# EAGLE design hss-mag-enc-v1 (EAGLE 7.6.0)
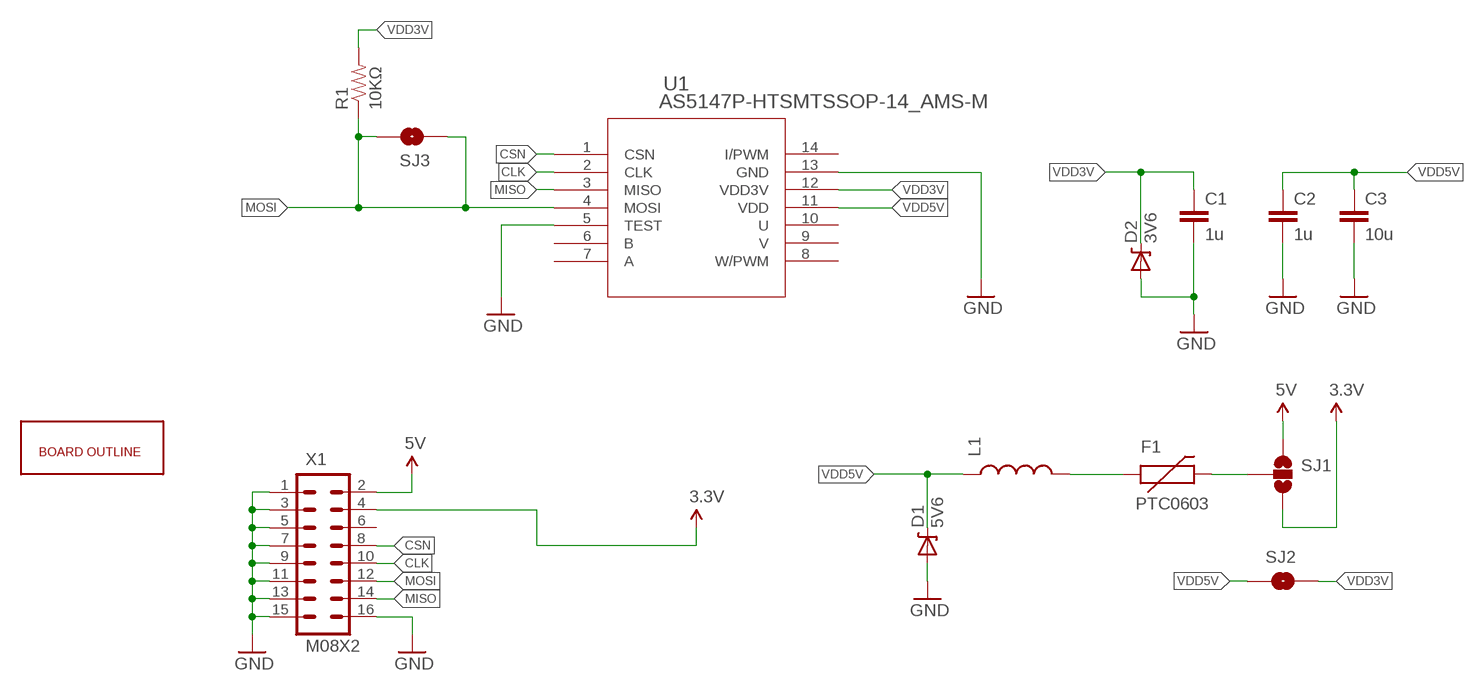
[diagram p0: schematic, sheet 1]

## Parts
C1  1u  CAP0805  [0805]
C2  1u  CAP0805  [0805]
C3  10u  CAP0805  [0805]
D1  5V6  DIODE-ZENER-BZT52  [SOD-323]
D2  3V6  DIODE-ZENER-BZT52  [SOD-323]
F1  PTC0603  [0603]
L1  INDUCTOR0805  [0805]
R1  10KΩ  RESISTOR0603-RES  [0603-RES]
SJ1  SOLDERJUMPER_2WAYS  [SJ_3]
SJ2  SOLDERJUMPERNO  [SJ_2S-NO]
SJ3  SOLDERJUMPERNO  [SJ_2S-NO]
U1  AS5147P-HTSMTSSOP-14_AMS-M  [TSSOP-14_AMS-M]
U$1  BOARD-OUTLINE-V1  [BOARD-OUTLINE]
X1  M08X2  [2X8]

## Nets
3.3V: SJ1.3 X1.4
5V: SJ1.1 X1.2
CLK: U1.2(CLK) X1.10
CSN: U1.1(CSN) X1.8
GND: C1.2 C2.2 C3.2 D1.2(A) D2.2(A) U1.5(TEST) U1.13(GND) X1.1 X1.3 X1.5 X1.7 X1.9 X1.11 X1.13 X1.15 X1.16
MISO: U1.3(MISO) X1.14
MOSI: R1.1 SJ3.1 SJ3.2 U1.4(MOSI) X1.12
N$1: F1.1 L1.2
N$2: F1.2 SJ1.2
VDD3V: C1.1 D2.1(C) R1.2 SJ2.2 U1.12(VDD3V)
VDD5V: C2.1 C3.1 D1.1(C) L1.1 SJ2.1 U1.11(VDD)
Unconnected: U1.6(B) U1.7(A) U1.8(W/PWM) U1.9(V) U1.10(U) U1.14(I/PWM) X1.6

## Library data of the parts
C1-C3 = hss-mag-enc:CAP: Capacitor Standard 0603 ceramic capacitor, and 0.1" leaded capacitor.
D1 D2 = hss-mag-enc:DIODE-ZENER: Zener Diode Production Part - 8199 3.4V Zener Voltage
F1 = hss-mag-enc:PTC: Resettable Fuse PTC Resettable Fuse. Spark Fun Electronics SKU : COM-08357
L1 = hss-mag-enc:INDUCTOR: Inductors Basic Inductor/Choke - 0603 and 1206. Footprints are not proven and vary greatly between part numbers.
R1 = hss-mag-enc:RESISTOR: Resistor Basic schematic elements and footprints for 0603, 1206, and PTH resistors.
SJ1 = hss-mag-enc:SOLDERJUMPER_2WAY: Solder Jumper 2 way solder jumper
SJ2 SJ3 = hss-mag-enc:SOLDERJUMPER: Solder Jumper Standard SMD solder jumper. Used to automate production. Two varients : Normally Open and Normally Closed are the same, but have different paste layers. NC will have a large amount of paste and should jumper during reflow.
U1 = hss-mag-enc:AS5147P-HTSM; COPYRIGHT: Copyright (C) 2025 Ultra Librarian. All rights reserved.; MANUFACTURER_NAME: AMS; MANUFACTURER_PART_NUMBER: AS5147P-HTSM
U$1 = hss-mag-enc:BOARD-OUTLINE
X1 = hss-mag-enc:M08X2

## Board
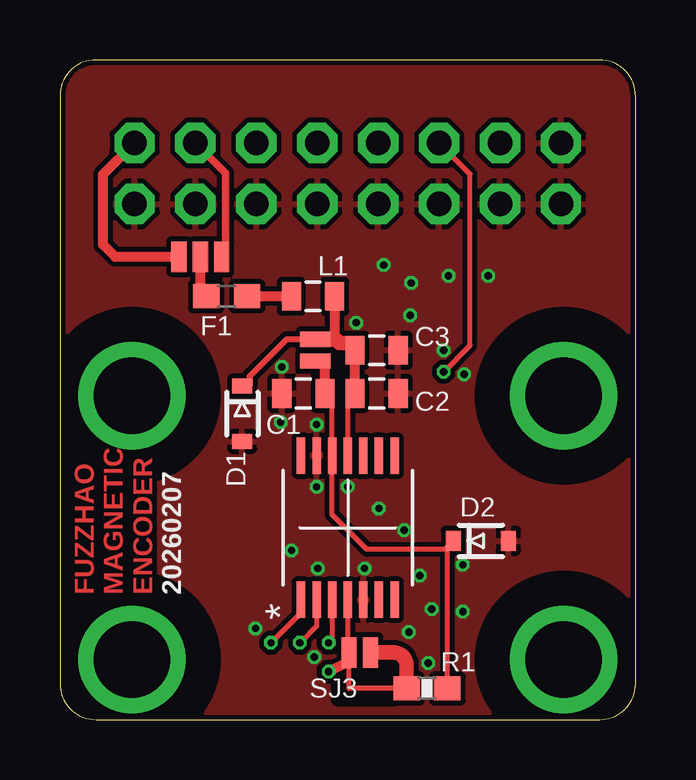
[diagram p1: board, top side]
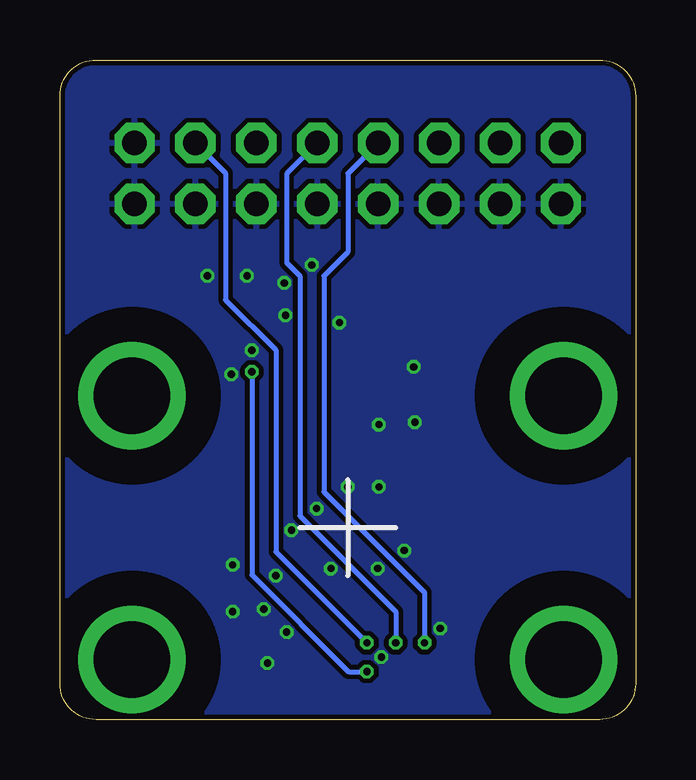
[diagram p2: board, bottom side, seen from below]

Size 24 x 27.5 mm. Coordinates in mm from the lower left corner, seen from the top.
Outline: 22.5,27.5 1.5,27.5 arc90 0,26 0,1.5 arc90 1.5,0 22.5,0 arc90 24,1.5 24,26 arc90 22.5,27.5
Copper layers (1*16): Top 0.035mm / dielectric 0.2mm / Bottom 0.035mm
Design rules "jlcpcb-4layers *": minimum track width 3mil, minimum drill 0.2mm, track to track 5mil, track to pad 5mil, pad to pad 5mil, via to via 5mil, smd to smd 5mil, copper to edge 0.2mm, drill to drill 6mil, minimum pad ring 8mil, minimum via ring 0.13mm, stop-mask expansion 0.05mm, vias tented up to drill 16mil, thermal gap 8mil
tRestrict: 2 lines

### Footprints (pad centres in the part's own frame; a part is rotated, then mirrored left to right if it is on the bottom)
0805 = smd 0.8 x 1.2: 1 -0.9,0; 2 0.9,0
SOD-323 = smd 0.63 x 0.83: 1 -1.15,0; 2 1.15,0
0603 = smd 1.1 x 1: 1 -0.85,0; 2 0.85,0
0603-RES = smd 1.1 x 1: 1 -0.85,0; 2 0.85,0
SJ_3 = smd 0.635 x 1.27: 1 -0.889,0; 2 0,0; 3 0.889,0
SJ_2S-NO = smd 0.635 x 1.27: 1 -0.45,0; 2 0.45,0
TSSOP-14_AMS-M = smd 1.511 x 0.356: 1 -3.004,1.95; 2 -3.004,1.3; 3 -3.004,0.65; 4 -3.004,0; 5 -3.004,-0.65; 6 -3.004,-1.3; 7 -3.004,-1.95; 8 3.004,-1.95; 9 3.004,-1.3; 10 3.004,-0.65; 11 3.004,0; 12 3.004,0.65; 13 3.004,1.3; 14 3.004,1.95
BOARD-OUTLINE = drill 3.2 pad 3.81: 1 2,2; 2 2,13; 3 20,13; 4 20,2
2X8 = drill 1.016 pad 1.676 octagon: 1 0,0; 2 0,2.54; 3 2.54,0; 4 2.54,2.54; 5 5.08,0; 6 5.08,2.54; 7 7.62,0; 8 7.62,2.54; 9 10.16,0; 10 10.16,2.54; 11 12.7,0; 12 12.7,2.54; 13 15.24,0; 14 15.24,2.54; 15 17.78,0; 16 17.78,2.54

### Placement (x,y rotation side)
C1  10.15,13.6 180 top
C2  13.2,13.6 0 top
C3  13.2,15.4 0 top
D1  7.6,12.75 270 top
D2  17.55,7.45 0 top
F1  6.95,17.65 180 top
L1  10.55,17.65 180 top
R1  15.3,1.3 0 top
SJ1  5.85,19.3 0 top
SJ2  10.65,15.4 270 top
SJ3  12.5,2.8 180 top
U1  12,8 90 top
U$1  1,0.5 0 top
X1  3.11,21.5 0 top

### Tracks (layer width: path | path; a pad name or v marks a point on that pad's centre or on a via)
3.3V
  Top 0.305: X1.4 6.9,22.79 6.9,19.85 6.74,19.69 SJ1.3
5V
  Top 0.406: X1.2 1.8,22.73 1.8,19.8 2.3,19.3 SJ1.1
CLK  (via drill 0.3)
  Top 0.203: U1.2 10.7,3.9 v10,3.2
  Bottom 0.203: X1.10 14.55,22.76 14.55,19.05 14,18.5 14,8.5 10,4.5 v10,3.2
CSN  (via drill 0.3)
  Top 0.203: U1.1 10.05,4.45 v8.8,3.2
  Bottom 0.203: X1.8 12,22.77 12,19.5 13,18.5 13,9.5 8.8,5.3 v8.8,3.2
GND  (via drill 0.3)
  other vias: 12.7,6.3 9.2,12.4 10.7,9.7 12,9.7 13.3,8.8 14.35,7.9 15,6 15.5,4.6 14.55,3.65 15.35,2.35 10.6,2.6 10.75,6.3 16,15.4 14.6,16.85 16.85,14.4 16.8,4.5 16.8,6.45 8.15,3.8 9.65,7.05 12.35,16.55 14.65,18.2 13.5,18.95 17.85,18.5 16.2,18.5 9.25,14.7 10.7,12.3
  pour Top (isolate 0.203): 0,-0.5 24,-0.5 24,27.5 0,27.5
  pour Bottom (isolate 0.203): 0,-0.5 24,-0.5 24,27.5 0,27.5
MISO  (via drill 0.3)
  Top 0.203: U1.3 11.35,3.2 v11.2,3.2
  Bottom 0.203: X1.14 17.1,22.79 17.1,17.5 15,15.4 15,7 v11.2,3.2
MOSI  (via drill 0.3)
  Top 0.203: R1.1 12.05,1.3 12.05,2.4 SJ3.2 12.05,3 12,3 U1.4 | v16,14.5 17.1,15.6 17.1,22.75 X1.12
  Top 0.406: 12.05,2.4 v11.2,2
  Top 0.61: SJ3.1 13.91,2.8 arc-90 14.45,2.26 R1.1
  Bottom 0.203: v16,14.5 16,6.03 11.97,2 v11.2,2
N$1
  Top 0.406: F1.1 L1.2
N$2
  Top 0.406: SJ1.2 5.85,17.65 F1.2
VDD3V
  Top 0.203: R1.2 16.15,7.1 16.05,7.1 | 16.05,7.1 12.79,7.1 11.35,8.54 U1.12 11.35,13.25 C1.1 | 16.05,7.1 D2.1
  Top 0.406: C1.1 11.05,14.95 SJ2.2
VDD5V
  Top 0.203: U1.11 12,13.3 C2.1
  Top 0.254: SJ2.1 9.45,15.85 7.9,14.3 7.9,13.9 D1.1
  Top 0.406: C2.1 C3.1 | L1.1 11.45,15.85 SJ2.1
  Top 0.61: SJ2.1 11.5,15.85 11.65,15.7 12,15.7 C3.1

### Text on the board
Top: FUZZHAO / MAGNETIC / ENCODER
tPlace: 20260207
tStop: FUZZHAO / MAGNETIC / ENCODER
tDocu: 5V | 3V | NC | CS | CK | MO | SI | MI | SO | GND | 5V | 3V | 3V
bDocu: 5V | 3V | NC | CS | CK | SI | MO | SO | MI | GND